# EAGLE schematic analog-out-and-pwr-amp (EAGLE 6.5.0)
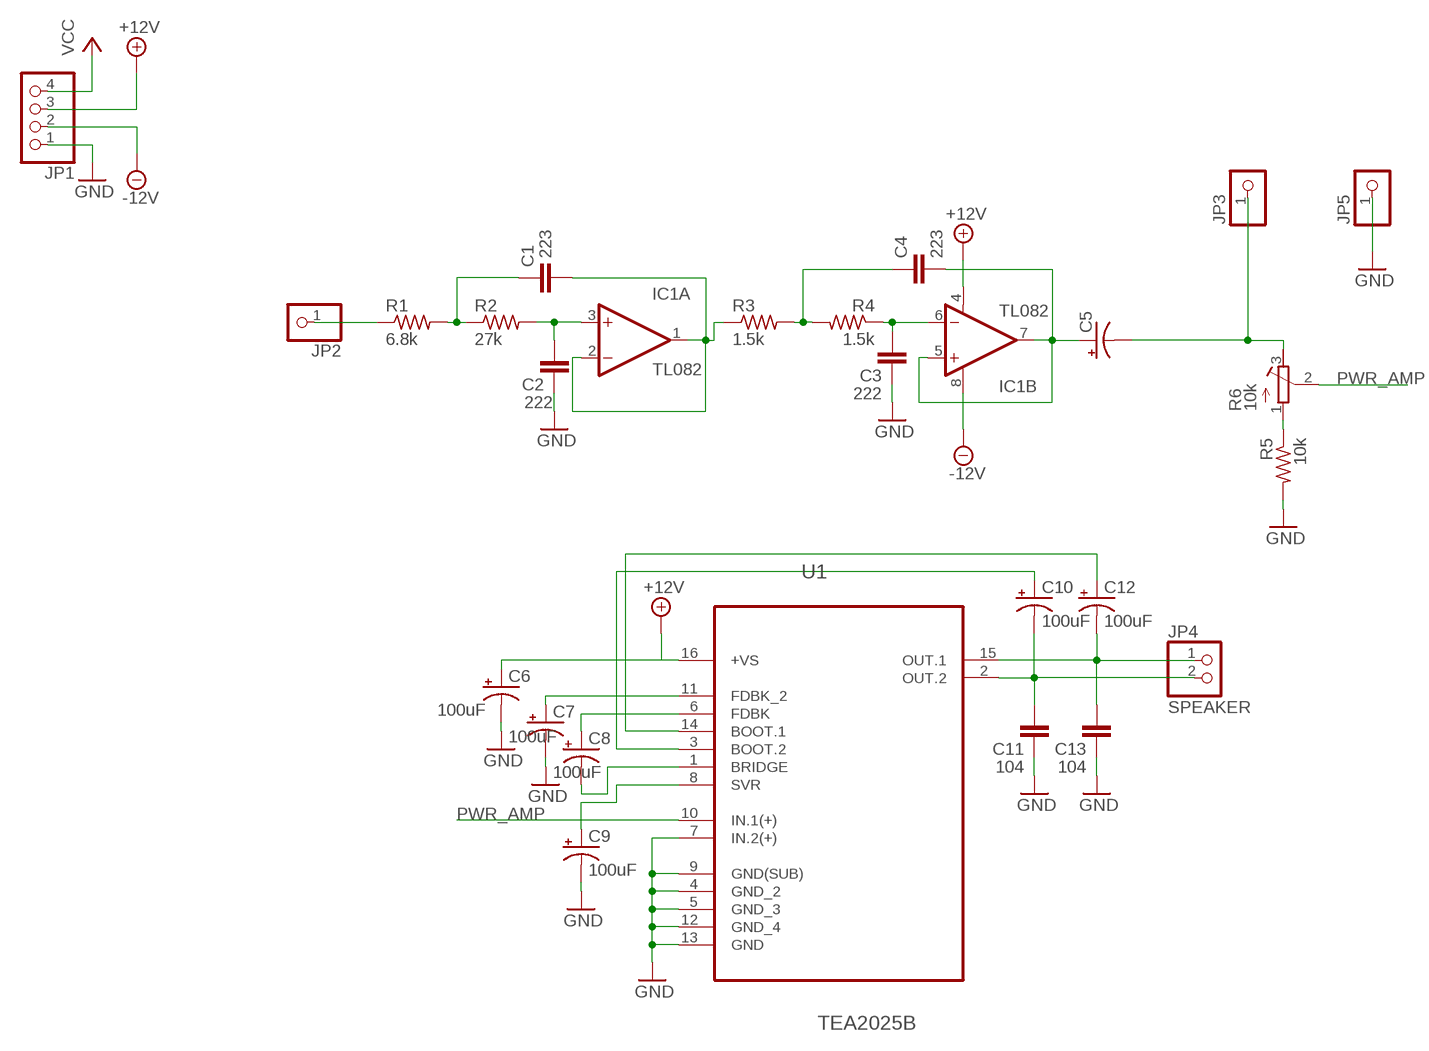
[diagram p0: schematic, sheet 1]

## Parts
C1  223  C-EUCERAMIC-CAP-COMMON  [C025-060X050]
C2  222  C-EUCERAMIC-CAP-COMMON  [C025-060X050]
C3  222  C-EUCERAMIC-CAP-COMMON  [C025-060X050]
C4  223  C-EUCERAMIC-CAP-COMMON  [C025-060X050]
C5  CPOL-USSANYO_D  [POL-CAP-COMMON]
C6  100uF  CPOL-USSANYO_D  [POL-CAP-COMMON]
C7  100uF  CPOL-USSANYO_D  [POL-CAP-COMMON]
C8  100uF  CPOL-USSANYO_D  [POL-CAP-COMMON]
C9  100uF  CPOL-USSANYO_D  [POL-CAP-COMMON]
C10  100uF  CPOL-USSANYO_D  [POL-CAP-COMMON]
C11  104  C-EUCERAMIC-CAP-COMMON  [C025-060X050]
C12  100uF  CPOL-USSANYO_D  [POL-CAP-COMMON]
C13  104  C-EUCERAMIC-CAP-COMMON  [C025-060X050]
IC1  TL082  [DIP08]
JP1  PINHD-1X4  [1X04]
JP2  PINHD-1X1  [1X01]
JP3  PINHD-1X1  [1X01]
JP4  SPEAKER  PINHD-1X20.5"  [1X02/0.5"]
JP5  PINHD-1X1  [1X01]
R1  6.8k  R-US_0207/10  [R-US-COMMON]
R2  27k  R-US_0207/10  [R-US-COMMON]
R3  1.5k  R-US_0207/10  [R-US-COMMON]
R4  1.5k  R-US_0207/10  [R-US-COMMON]
R5  10k  R-US_0207/10  [R-US-COMMON]
R6  10k  R-TRIMM64W  [RTRIM-COMMON]
U1  TEA2025B  [DIP254P762X510-16]

## Nets
+12V: C6.+ IC1.4(B:V-) JP1.3 U1.16(+VS)
-12V: IC1.8(B:V+) JP1.2
GND: C2.1 C3.1 C6.- C7.- C9.- C11.1 C13.1 JP1.1 JP5.1 R5.2 U1.4(GND_2) U1.5(GND_3) U1.7(IN.2(+)) U1.9(GND(SUB)) U1.12(GND_4) U1.13(GND)
N$1: C4.2 C5.+ IC1.5(B:+IN) IC1.7(B:OUT)
N$2: JP2.1 R1.1
N$3: R5.1 R6.1(A)
N$4: C1.1 R1.2 R2.1
N$5: C2.2 IC1.3(A:+IN) R2.2
N$6: C1.2 IC1.1(A:OUT) IC1.2(A:-IN) R3.1
N$7: C4.1 R3.2 R4.2
N$8: C3.2 IC1.6(B:-IN) R4.1
N$9: C5.- JP3.1 R6.3(E)
N$10: C7.+ U1.11(FDBK_2)
N$11: C8.+ U1.6(FDBK)
N$12: C8.- U1.1(BRIDGE)
N$13: C12.- C13.2 JP4.1 U1.15(OUT.1)
N$14: C12.+ U1.14(BOOT.1)
N$15: C10.- C11.2 JP4.2 U1.2(OUT.2)
N$16: C10.+ U1.3(BOOT.2)
N$17: C9.+ U1.8(SVR)
PWR_AMP: R6.2(S) U1.10(IN.1(+))
VCC: JP1.4

## Library data of the parts
C1-C4 C11 C13 = datle-discrete:C-EU: CAPACITOR, European symbol
C5-C10 C12 = datle-discrete:CPOL-US: POLARIZED CAPACITOR, American symbol
IC1 = datle-analogic:TL082
JP1 = pinhead:PINHD-1X4: PIN HEADER
JP2 JP3 JP5 = datle-conn:PINHD-1X1: PIN HEADER
JP4 = datle-conn:PINHD-1X2: PIN HEADER
R1-R5 = datle-discrete:R-US_: RESISTOR, American symbol
R6 = datle-discrete:R-TRIMM: Trimm resistor
U1 = datle-analogic:TEA2025B: STREO AUDIO AMPLIFIER; MPN: TEA2025B; OC_FARNELL: 1263004; OC_NEWARK: 89K1062; PACKAGE: PDIP-16; SUPPLIER: STMICROELECTRONICS